# EAGLE schematic WifiGarage (EAGLE 6.2)
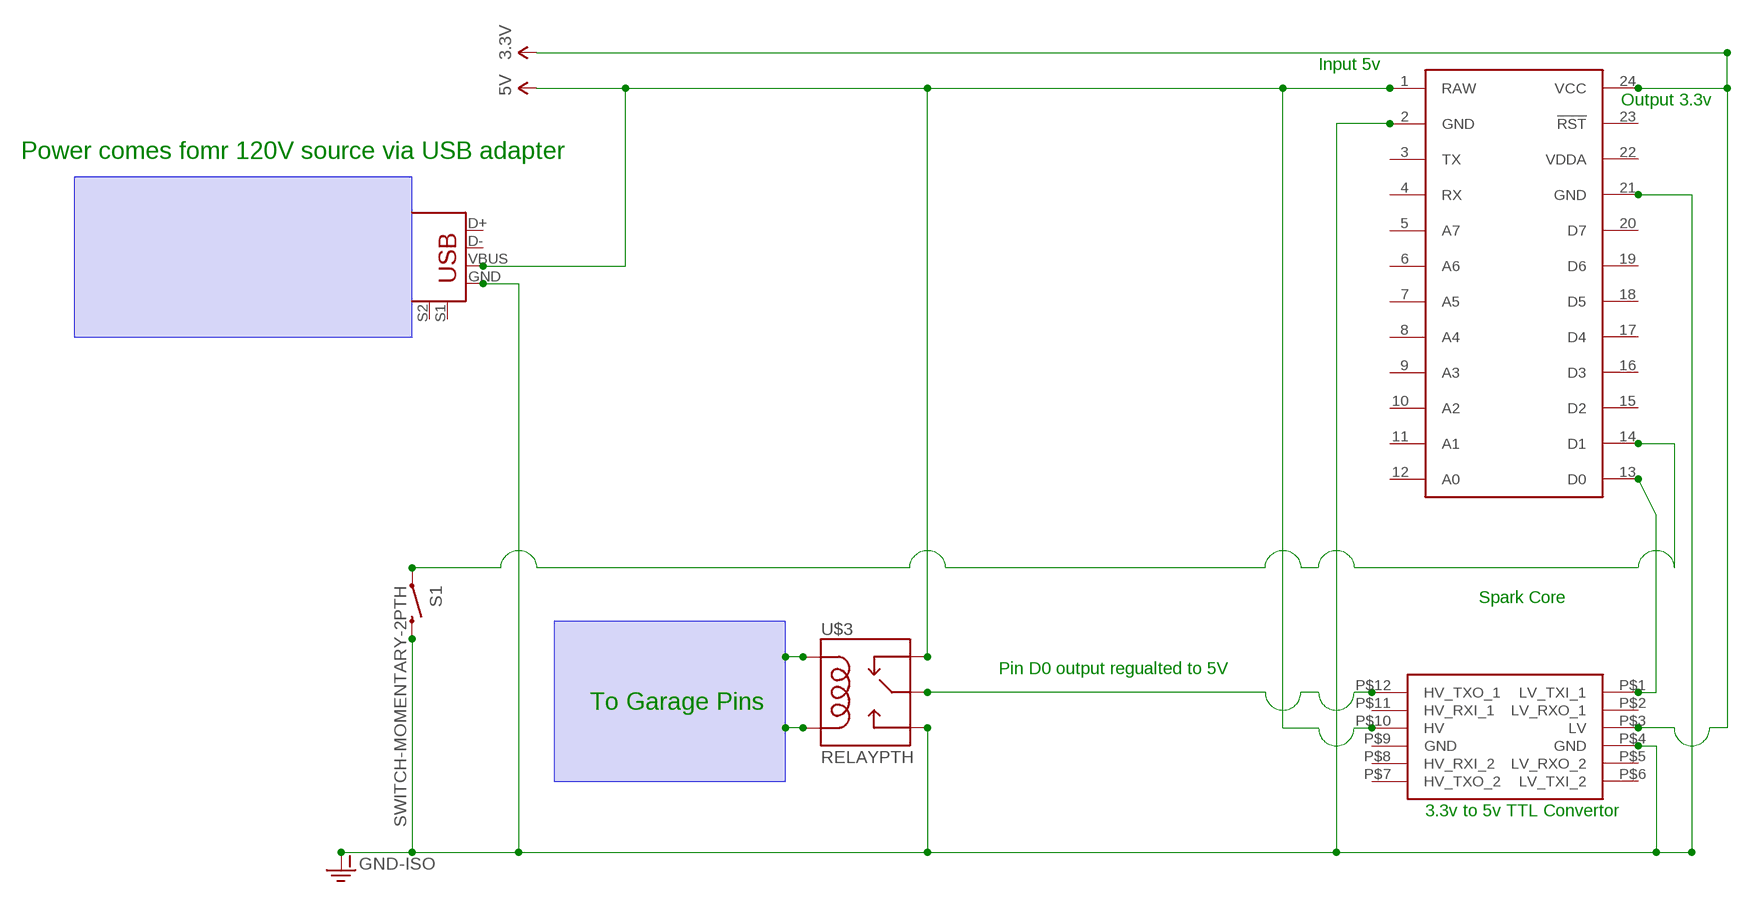
[diagram p0: schematic, sheet 1]

## Parts
S1  SWITCH-MOMENTARY-2PTH  [TACTILE-PTH]
U$1  SPARK_CORECORE  [SPARK_CORE]
U$2  LOGIC_LEVEL_CONVERTER  [LOGIC_LEVEL_CONVERTER]
U$3  RELAYPTH  [RELAY-G5Q]
U$4  USB+SHIELD  [USB-B-PTH]

## Nets
3.3V: U$1.24(VCC) U$2.P$3(LV)
5V: U$1.1(RAW) U$2.P$10(HV) U$3.4(NC) U$4.VBUS
GND-ISO: S1.3 U$1.2(GND) U$1.21(GND) U$2.P$4(GND) U$3.3(NO) U$4.GND
N$1: U$1.13(D0) U$2.P$1(LV_TXI_1)
N$2: U$2.P$12(HV_TXO_1) U$3.2(MAIN)
N$3: U$3.5(COIL1)
N$4: U$3.1(COIL2)
N$5: S1.1 U$1.14(D1)
Unconnected: U$1.3(TX) U$1.4(RX) U$1.5(A7) U$1.6(A6) U$1.7(A5) U$1.8(A4) U$1.9(A3) U$1.10(A2) U$1.11(A1) U$1.12(A0) U$1.15(D2) U$1.16(D3) U$1.17(D4) U$1.18(D5) U$1.19(D6) U$1.20(D7) U$1.23(!RST) U$2.P$2(LV_RXO_1) U$2.P$5(LV_RXO_2) U$2.P$6(LV_TXI_2) U$2.P$7(HV_TXO_2) U$2.P$8(HV_RXI_2) U$2.P$9(GND) U$2.P$11(HV_RXI_1) U$4.D+ U$4.D- U$4.S1 U$4.S2

## Notes on the sheet
- Input 5v
- Output 3.3v
- Power comes fomr 120V source via USB adapter
- Spark Core
- Pin D0 output regualted to 5V
- To Garage Pins
- 3.3v to 5v TTL Convertor

## Power pins joined to a net without a drawn wire
VDDA: U$1.22(VDDA)

## Library data of the parts
S1 = SparkFun-Electromechanical:SWITCH-MOMENTARY-2: Various NO switches- pushbuttons, reed, etc
U$1 = Spark:SPARK_CORE
U$2 = SparkFun-Boards:LOGIC_LEVEL_CONVERTER: Logic Level Converter (3.3v - 5v) https://www.sparkfun.com/products/8745
U$3 = SparkFun-Electromechanical:RELAY: SPDT relay (COM-00101)
U$4 = SparkFun-Connectors:USB+SHIELD: USB+Shield USB connector with shield pins connectable